# Altium schematic sheet Level Shifting.SchDoc
size 297 x 209 mm; SheetNumber: 16; SheetTotal: 29
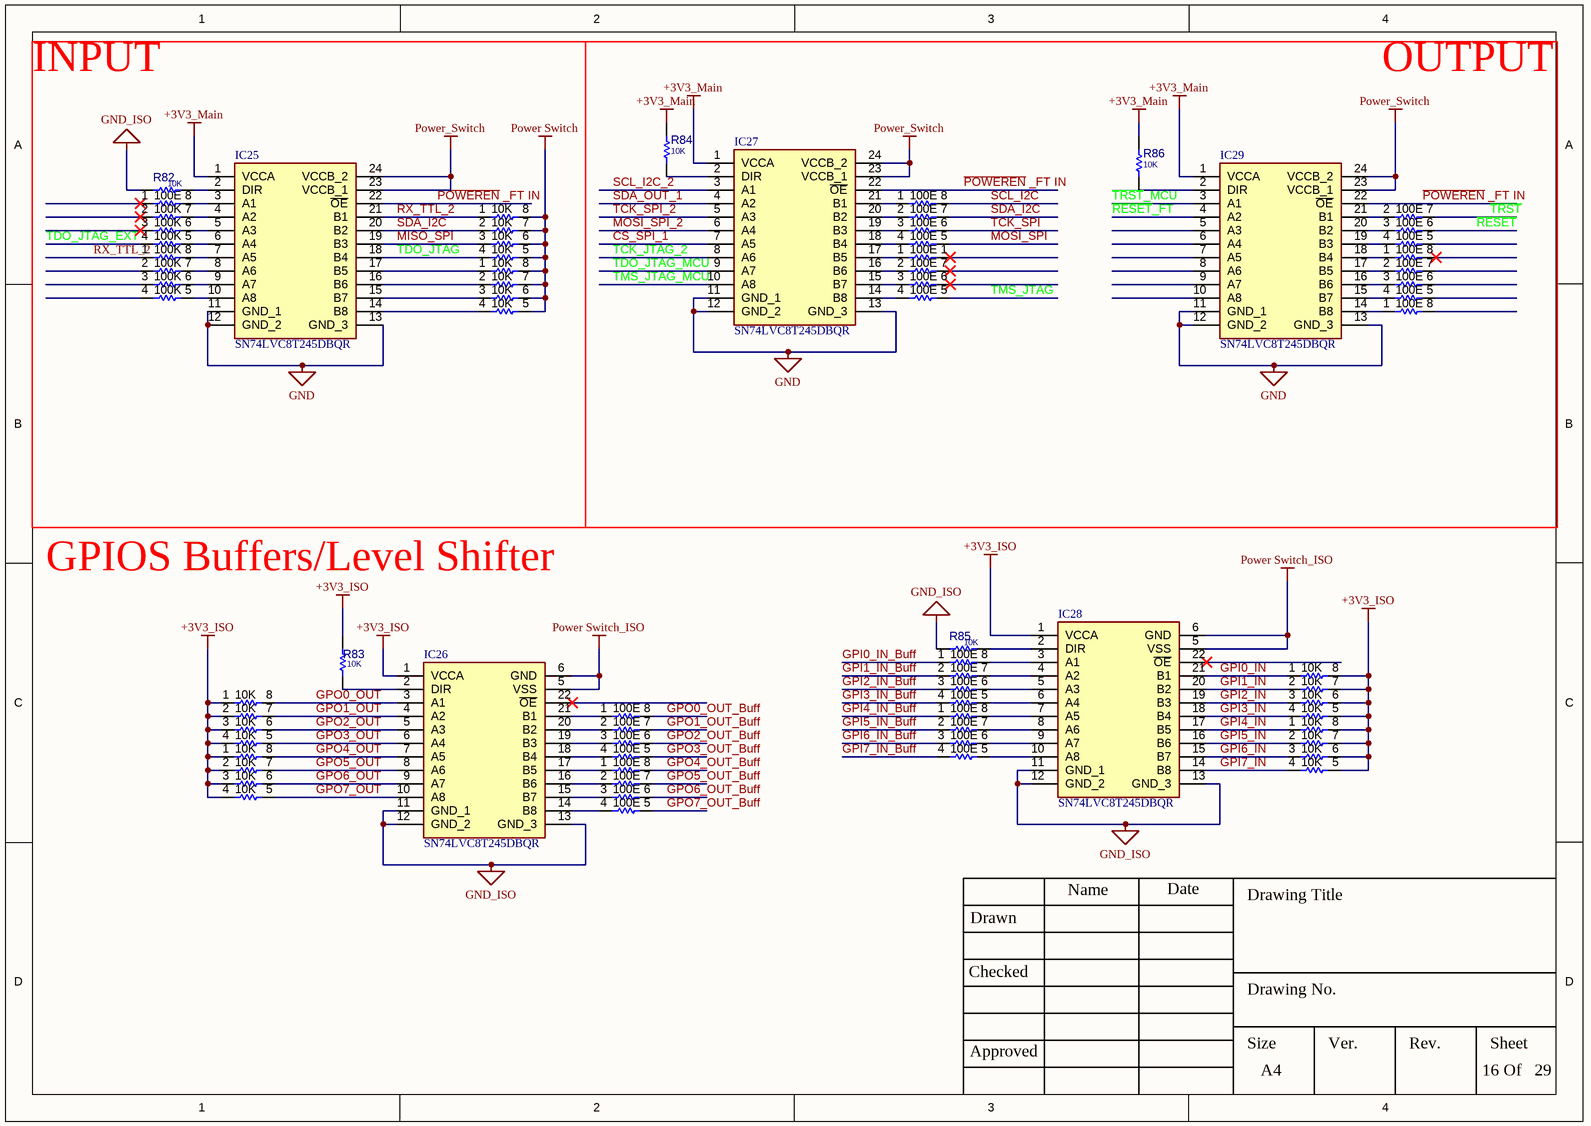
[diagram p0: Level Shifting.SchDoc]

## Parts
1  value 10K  [RP0603X4]  (hidden comment: Film Res Pack)  (part A of 4)
IC25  SN74LVC8T245DBQR  [SOP64P600X175-24N]
IC26  SN74LVC8T245DBQR  [SOP64P600X175-24N]
IC27  SN74LVC8T245DBQR  [SOP64P600X175-24N]
IC28  SN74LVC8T245DBQR  [SOP64P600X175-24N]
IC29  SN74LVC8T245DBQR  [SOP64P600X175-24N]
R82  10K  [R0603]
R83  10K  [R0603]
R84  10K  [R0603]
R85  10K  [R0603]
R86  10K  [R0603]
RA1  value 100K  [RP0603X4]  (hidden comment: Film Res Pack)  (parts A,B,C,D of 4)
RA2  value 100E  [RP0603X4]  (hidden comment: Film Res Pack)  (parts A,B,C,D of 4)
RA3  value 10K  [RP0603X4]  (hidden comment: Film Res Pack)  (parts A,B,C,D of 4)
RA4  value 10K  [RP0603X4]  (hidden comment: Film Res Pack)  (parts A,B,C,D of 4)
RA5  value 10K  [RP0603X4]  (hidden comment: Film Res Pack)  (parts A,B,C,D of 4)
RA6  value 100E  [RP0603X4]  (hidden comment: Film Res Pack)  (parts A,B,C,D of 4)
RA7  value 100E  [RP0603X4]  (hidden comment: Film Res Pack)  (parts A,B,C,D of 4)
RA8  value 100E  [RP0603X4]  (hidden comment: Film Res Pack)  (parts A,B,C,D of 4)
RA9  value 100E  [RP0603X4]  (hidden comment: Film Res Pack)  (parts A,B,C,D of 4)
RA10  value 100E  [RP0603X4]  (hidden comment: Film Res Pack)  (parts A,B,C,D of 4)
RA11  value 100E  [RP0603X4]  (hidden comment: Film Res Pack)  (parts A,B,C,D of 4)
RA12  value 10K  [RP0603X4]  (hidden comment: Film Res Pack)  (parts A,B,C,D of 4)
RA13  value 10K  [RP0603X4]  (hidden comment: Film Res Pack)  (parts A,B,C,D of 4)
RA14  value 100E  [RP0603X4]  (hidden comment: Film Res Pack)  (parts A,B,C,D of 4)
RA15  value 100E  [RP0603X4]  (hidden comment: Film Res Pack)  (parts A,B,C,D of 4)
RA16  value 100E  [RP0603X4]  (hidden comment: Film Res Pack)  (parts B,C,D of 4)

## Nets
+3V3_ISO: 1.1 IC26.1(VCCA) IC28.1(VCCA) R83.1 RA3.1 RA3.2 RA3.3 RA3.4 RA4.2 RA4.3 RA4.4 RA12.8 RA13.5 RA13.6 RA13.7 RA13.8 RA14.5 RA14.6 RA14.7
+3V3_Main: IC25.1(VCCA) IC27.1(VCCA) IC29.1(VCCA) R84.1 R86.1
GND: IC25.11(GND_1) IC25.12(GND_2) IC25.13(GND_3) IC27.11(GND_1) IC27.12(GND_2) IC27.13(GND_3) IC29.11(GND_1) IC29.12(GND_2) IC29.13(GND_3)
GND_ISO: IC26.11(GND_1) IC26.12(GND_2) IC26.13(GND_3) IC28.11(GND_1) IC28.12(GND_2) IC28.13(GND_3) R82.1 R85.1
Power Switch: RA4.8 RA5.5 RA5.6 RA5.7 RA5.8 RA6.5 RA6.6 RA6.7
Power Switch_ISO: IC26.5(VSS) IC26.6(GND) IC28.5(VSS) IC28.6(GND)
Power_Switch: IC25.23(VCCB_1) IC25.24(VCCB_2) IC27.23(VCCB_1) IC27.24(VCCB_2) IC29.23(VCCB_1) IC29.24(VCCB_2)
~{POWEREN} _FT IN: IC25.22(~{OE}) IC27.22(~{OE}) IC29.22(~{OE})
CS_SPI_1: IC27.7(A5)
GPI0_IN: IC28.21(B1) RA13.1
GPI0_IN_Buff: RA11.1
GPI1_IN: IC28.20(B2) RA14.2
GPI1_IN_Buff: RA12.2
GPI2_IN: IC28.19(B3) RA14.3
GPI2_IN_Buff: RA12.3
GPI3_IN: IC28.18(B4) RA14.4
GPI3_IN_Buff: RA12.4
GPI4_IN: IC28.17(B5) RA12.1
GPI4_IN_Buff: RA10.1
GPI5_IN: IC28.16(B6) RA13.2
GPI5_IN_Buff: RA11.2
GPI6_IN: IC28.15(B7) RA13.3
GPI6_IN_Buff: RA11.3
GPI7_IN: IC28.14(B8) RA13.4
GPI7_IN_Buff: RA11.4
GPO0_OUT: 1.8 IC26.3(A1)
GPO0_OUT_Buff: RA7.8
GPO1_OUT: IC26.4(A2) RA4.7
GPO1_OUT_Buff: RA8.7
GPO2_OUT: IC26.5(A3) RA4.6
GPO2_OUT_Buff: RA8.6
GPO3_OUT: IC26.6(A4) RA4.5
GPO3_OUT_Buff: RA8.5
GPO4_OUT: IC26.7(A5) RA3.8
GPO4_OUT_Buff: RA6.8
GPO5_OUT: IC26.8(A6) RA3.7
GPO5_OUT_Buff: RA7.7
GPO6_OUT: IC26.9(A7) RA3.6
GPO6_OUT_Buff: RA7.6
GPO7_OUT: IC26.10(A8) RA3.5
GPO7_OUT_Buff: RA7.5
MISO_SPI: IC25.19(B3) RA6.3
MOSI_SPI: RA10.5
MOSI_SPI_2: IC27.6(A4)
~{RESET}: RA16.6
~{RESET}_FT: IC29.4(A2)
RX_TTL_2: IC25.21(B1) RA1.1 RA5.1
SCL_I2C: RA9.8
SCL_I2C_2: IC27.3(A1)
SDA_I2C: IC25.20(B2) RA6.2 RA10.7
SDA_OUT_1: IC27.4(A2)
~{TRST}: RA16.7
~{TRST}_MCU: IC29.3(A1)
TCK_JTAG_2: IC27.8(A6)
TCK_SPI: RA10.6
TCK_SPI_2: IC27.5(A3)
TDO_JTAG: IC25.18(B4) RA6.4
TDO_JTAG_EXT: RA2.4
TDO_JTAG_MCU: IC27.9(A7)
TMS_JTAG: RA9.5
TMS_JTAG_MCU: IC27.10(A8)
NetIC25_2: IC25.2(DIR) R82.2
NetIC25_3: IC25.3(A1) RA2.8
NetIC25_4: IC25.4(A2) RA2.7
NetIC25_5: IC25.5(A3) RA2.6
NetIC25_6: IC25.6(A4) RA2.5
NetIC25_7: IC25.7(A5) RA1.8
NetIC25_8: IC25.8(A6) RA1.7
NetIC25_9: IC25.9(A7) RA1.6
NetIC25_10: IC25.10(A8) RA1.5
NetIC25_14: IC25.14(B8) RA5.4
NetIC25_15: IC25.15(B7) RA5.3
NetIC25_16: IC25.16(B6) RA5.2
NetIC25_17: IC25.17(B5) RA4.1
NetIC26_2: IC26.2(DIR) R83.2
NetIC26_14: IC26.14(B8) RA7.4
NetIC26_15: IC26.15(B7) RA7.3
NetIC26_16: IC26.16(B6) RA7.2
NetIC26_17: IC26.17(B5) RA6.1
NetIC26_18: IC26.18(B4) RA8.4
NetIC26_19: IC26.19(B3) RA8.3
NetIC26_20: IC26.20(B2) RA8.2
NetIC26_21: IC26.21(B1) RA7.1
NetIC27_2: IC27.2(DIR) R84.2
NetIC27_14: IC27.14(B8) RA9.4
NetIC27_15: IC27.15(B7) RA9.3
NetIC27_16: IC27.16(B6) RA9.2
NetIC27_17: IC27.17(B5) RA8.1
NetIC27_18: IC27.18(B4) RA10.4
NetIC27_19: IC27.19(B3) RA10.3
NetIC27_20: IC27.20(B2) RA10.2
NetIC27_21: IC27.21(B1) RA9.1
NetIC28_2: IC28.2(DIR) R85.2
NetIC28_3: IC28.3(A1) RA11.8
NetIC28_4: IC28.4(A2) RA12.7
NetIC28_5: IC28.5(A3) RA12.6
NetIC28_6: IC28.6(A4) RA12.5
NetIC28_7: IC28.7(A5) RA10.8
NetIC28_8: IC28.8(A6) RA11.7
NetIC28_9: IC28.9(A7) RA11.6
NetIC28_10: IC28.10(A8) RA11.5
NetIC29_2: IC29.2(DIR) R86.2
NetIC29_14: IC29.14(B8) RA14.1
NetIC29_15: IC29.15(B7) RA15.4
NetIC29_16: IC29.16(B6) RA15.3
NetIC29_17: IC29.17(B5) RA15.2
NetIC29_18: IC29.18(B4) RA15.1
NetIC29_19: IC29.19(B3) RA16.4
NetIC29_20: IC29.20(B2) RA16.3
NetIC29_21: IC29.21(B1) RA16.2

Not connected (* = marked no-connect by the designer): IC26 22(~{OE})*; IC28 22(~{OE})*; IC29 5(A3) 6(A4) 7(A5) 8(A6) 9(A7) 10(A8); RA1 2 3 4; RA2 1* 2* 3*; RA9 6* 7*; RA14 8; RA15 5 6 7 8*; RA16 5

## Notes on the sheet
- INPUT
- OUTPUT
- GPIOS Buffers/Level Shifter
- Drawn
- Name
- Date
- Drawing Title
- Checked
- Drawing No.
- Approved
- Size
- A4
- Ver.
- Rev.
- Sheet
- Of

## Library data of the parts
1 RA1-RA16 = RES_SMD_PACK_X4: RESISTOR, SMD, PACKX4; MANF_P#: MANF_PART#; MANF: MANF
IC25-IC29 = SN74LVC8T245DBQR: Integrated Circuit; Manufacturer_Name: Texas Instruments; Datasheet Link: http://www.ti.com/lit/gpn/sn74lvc8t245; Height: 1.75mm; Manufacturer_Part_Number: SN74LVC8T245DBQR; Mouser Part Number: 595-SN74LVC8T245DBQR; Mouser Price/Stock: https://www.mouser.co.uk/ProductDetail/Texas-Instruments/SN74LVC8T245DBQR?qs=dT9u2OTAaVXsrjZUGB3%252Bbw%3D%3D; Arrow Part Number: SN74LVC8T245DBQR; Arrow Price/Stock: https://www.arrow.com/en/products/sn74lvc8t245dbqr/texas-instruments?region=nac
R82-R86 = RES_SMD_0603: RESISTOR, SMD; PARAM: -W; DESC: DESCRIPTION; DIST#: MOUSER; PARAM2: 1%; MANF_P#: -; MANF: -; ASSEMBLY: ASSEMBLY; PRICE: 100= 0.5$; VALUE: 10K